# Altium schematic sheet UpdatedSch.SchDoc
size A
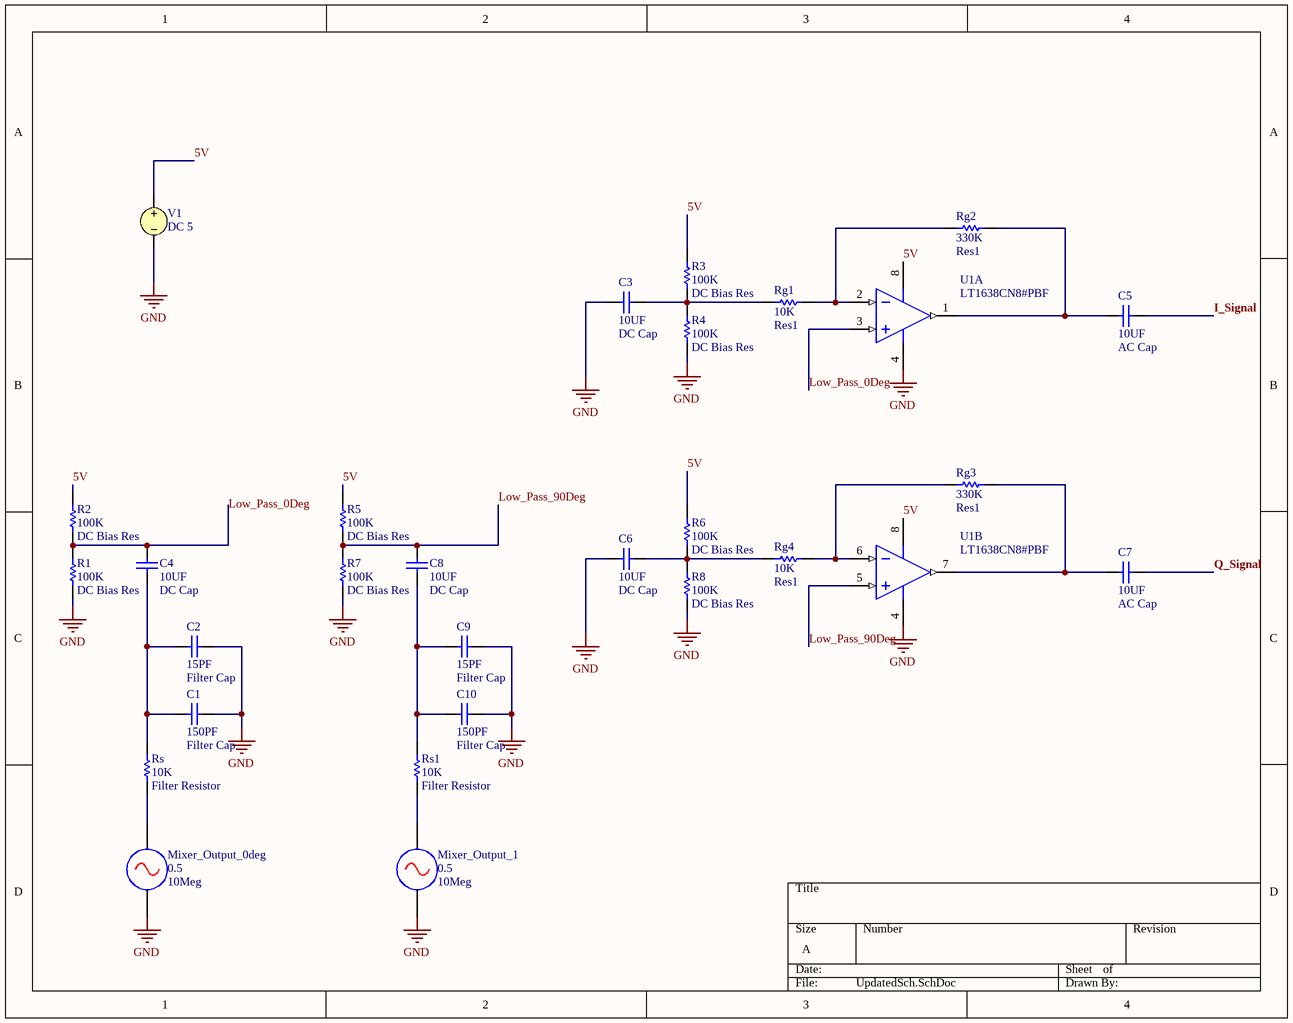
[diagram p0: UpdatedSch.SchDoc]

## Parts
C1  Filter Cap  value 150PF  [RADIAL-0.1]
C2  Filter Cap  value 15PF  [RADIAL-0.1]
C3  DC Cap  value 10UF  [RADIAL-0.1]
C4  DC Cap  value 10UF  [RADIAL-0.1]
C5  AC Cap  value 10UF  [RADIAL-0.1]
C6  DC Cap  value 10UF  [RADIAL-0.1]
C7  AC Cap  value 10UF  [RADIAL-0.1]
C8  DC Cap  value 10UF  [RADIAL-0.1]
C9  Filter Cap  value 15PF  [RADIAL-0.1]
C10  Filter Cap  value 150PF  [RADIAL-0.1]
Mixer_Output_0deg  Amp: 0.5  Freq: 10Meg  (hidden comment: AC Voltage Source)
Mixer_Output_1  Amp: 0.5  Freq: 10Meg  (hidden comment: AC Voltage Source)
R1  DC Bias Res  value 100K  [AXIAL-0.1-RES]
R2  DC Bias Res  value 100K  [AXIAL-0.1-RES]
R3  DC Bias Res  value 100K  [AXIAL-0.1-RES]
R4  DC Bias Res  value 100K  [AXIAL-0.1-RES]
R5  DC Bias Res  value 100K  [AXIAL-0.1-RES]
R6  DC Bias Res  value 100K  [AXIAL-0.1-RES]
R7  DC Bias Res  value 100K  [AXIAL-0.1-RES]
R8  DC Bias Res  value 100K  [AXIAL-0.1-RES]
Rg1  Res1  value 10K  [AXIAL-0.1-RES]
Rg2  Res1  value 330K  [AXIAL-0.1-RES]
Rg3  Res1  value 330K  [AXIAL-0.1-RES]
Rg4  Res1  value 10K  [AXIAL-0.1-RES]
Rs  Filter Resistor  value 10K  [AXIAL-0.1-RES]
Rs1  Filter Resistor  value 10K  [AXIAL-0.1-RES]
U1  LT1638CN8#PBF  [LT-N8-8]  (parts A,B of 2)
V1  DC 5

## Nets
GND: C1.2 C2.2 C3.2 C6.2 C9.2 C10.2 Mixer_Output_0deg.2 Mixer_Output_1.2 R1.1 R4.1 R7.1 R8.1 U1.4(V-) V1.2
5V: R2.2 R3.2 R5.2 R6.2 U1.8(V+) V1.1
I_Signal: C5.1
Low_Pass_0Deg: C4.2 R1.2 R2.1 U1.3(+IN_A)
Low_Pass_90Deg: C8.2 R5.1 R7.2 U1.5(+IN_B)
Q_Signal: C7.1
NetC1_1: C1.1 C2.1 C4.1 Rs.2
NetC3_1: C3.1 R3.1 R4.2 Rg1.1
NetC5_2: C5.2 Rg2.2 U1.1(OUT_A)
NetC6_1: C6.1 R6.1 R8.2 Rg4.1
NetC7_2: C7.2 Rg3.2 U1.7(OUT_B)
NetC8_1: C8.1 C9.1 C10.1 Rs1.2
NetMixer_Output_0deg_1: Mixer_Output_0deg.1 Rs.1
NetMixer_Output_1_1: Mixer_Output_1.1 Rs1.1
NetRg1_2: Rg1.2 Rg2.1 U1.2(-IN_A)
NetRg3_1: Rg3.1 Rg4.2 U1.6(-IN_B)

## Library data of the parts
C1 C10 = CAP CER 150PF 50V C0G/NP0 RADIAL: Capacitor; Manufacturer Part Number: K151J15C0GF53L2; Designator: C?; Voltage Rating: 50V; Published: 8-Jun-2000; LatestRevisionDate: 17-Jul-2002; LatestRevisionNote: Re-released for DXP Platform.; Publisher: Altium Limited
C2 C9 = CAP CER 15PF 50V C0G/NP0 RADIAL: Capacitor; Manufacturer Part Number: K150J15C0GF5TL2; Designator: C?; Voltage Rating: 50V; Published: 8-Jun-2000; LatestRevisionDate: 17-Jul-2002; LatestRevisionNote: Re-released for DXP Platform.; Publisher: Altium Limited
C3-C8 = CAP ALUM 10UF 20% 63V RADIAL: Capacitor; Manufacturer Part Number: ESK106M063AC3FA; Designator: C?; Voltage Rating: 63V; Published: 8-Jun-2000; LatestRevisionDate: 17-Jul-2002; LatestRevisionNote: Re-released for DXP Platform.; Publisher: Altium Limited
Mixer_Output_0deg Mixer_Output_1 = AC Voltage Source: SimulationGenericComponent: True; DC: 0; Phase: 0; Rser: 0; Cpar: 0
R1-R8 = RES 100K OHM 5% 1/4W AXIAL: Resistor; Manufacturer Part Number: CFR-25JB-52-100K; Designator: R?; Power Rating: 1/4W; Tolerance: 0.05; Published: 8-Jun-2000; LatestRevisionDate: 17-Jul-2002; LatestRevisionNote: Re-released for DXP Platform.; Publisher: Altium Limited
Rg1 Rg4 Rs Rs1 = RES 10K OHM 5% 1/4W AXIAL: Resistor; Manufacturer Part Number: CFR-25JB-52-10K; Designator: R?; Power Rating: 1/4W; Tolerance: 0.05; Published: 8-Jun-2000; LatestRevisionDate: 17-Jul-2002; LatestRevisionNote: Re-released for DXP Platform.; Publisher: Altium Limited
Rg2 Rg3 = RES 330K OHM 5% 1/4W AXIAL: Resistor; Manufacturer Part Number: CFR-25JB-52-330K; Designator: R?; Power Rating: 1/4W; Tolerance: 0.05; Published: 8-Jun-2000; LatestRevisionDate: 17-Jul-2002; LatestRevisionNote: Re-released for DXP Platform.; Publisher: Altium Limited
U1 = CMP-0359-01111-2: Dual Channel, High Voltage, Micropower Rail-to-Rail Operational Amplifier, 1.2 MHz Typical GBW, 0.38 V/us Typical SR, 2.2 to 44 V, 8-Pin DIP (N8-8), Commercial, Pb-Free; Manufacturer: Linear Technology; Linear Technology Part Number: LT1638; Vos (mV) Typical: 0.2; Vos (mV) Guaranteed: 0.6; Vs Max (V): 44; Vs Min (V): 2.2; SR (V/us) Typical: 0.38; Channels (#): 2; GBW (MHz) Typical: 1.2; Is (mA) Typical: 0.17; PackageVersion: Rev I; ComponentLink3URL: http://cds.linear.com/docs/en/packaging/05081510_I_N8.pdf; PackageDescription: 8-Lead PDIP, Body 10.16 x 6.48 mm, Pitch 2.54 mm; Mounting Technology: Surface Mount; ComponentLink2URL: http://cds.linear.com/docs/en/datasheet/16389fg.pdf; ComponentLink1URL: http://www.linear.com/; ComponentLink3Description: Package Specification; RevisionNote: URLs updated; PackageReference: LT-N8-8; PartNumber: LT1638CN8#PBF; DatasheetVersion: Rev. G; ComponentLink1Description: Manufacturer URL; ComponentLink2Description: Datasheet; Type: VFB; RoHS: Pb-Free
V1 = VSRC: Voltage Source; Note: PCB Footprint - Not required; AC Magnitude: 1; AC Phase: 0; Value: 5; Published: 8-Jun-2000; LatestRevisionDate: 17-Jul-2002; LatestRevisionNote: Re-released for DXP Platform.; PackageReference: Not Applicable; Publisher: Altium Limited